# EAGLE design mainbrd (EAGLE 5.06)
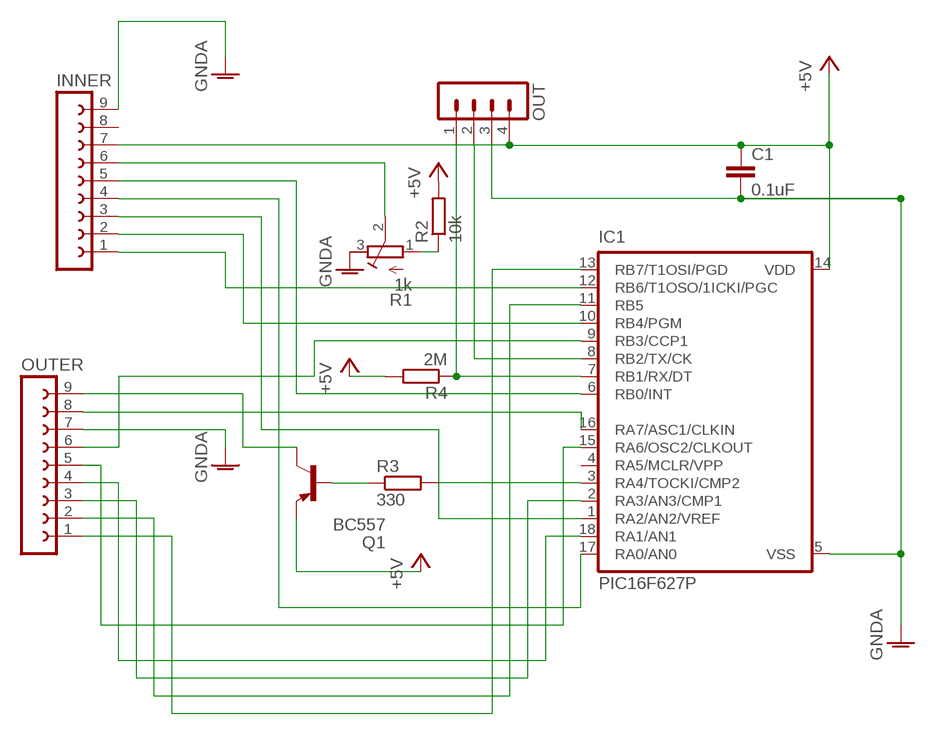
[diagram p0: schematic, sheet 1]

## Parts
C1  0.1uF  C5/2.5  [C5B2.5]
IC1  PIC16F627P  [DIL18]
INNER  FE09-1-SQU  [FE09-SQU]
OUT  MA04-1  [MA04-1]
OUTER  FE09-1-SQU  [FE09-SQU]
Q1  BC557  -PNP-TO92-CBE  [TO92-CBE]
R1  1k  R-TRIMM3339P  [RTRIM3339P]
R2  10k  R-EU_0207/10  [0207/10]
R3  330  R-EU_0207/10  [0207/10]
R4  2M  R-EU_0207/10  [0207/10]

## Nets
+5V: C1.1 IC1.14(VDD) INNER.7 OUT.4 Q1.E R2.2 R4.2
BL+V: OUTER.9 Q1.C
CONTRAST: INNER.6 R1.2(S)
D0: IC1.17(RA0/AN0) INNER.4
D1: IC1.18(RA1/AN1) OUTER.4
D2: IC1.1(RA2/AN2/VREF) INNER.3
D3: IC1.2(RA3/AN3/CMP1) OUTER.3
D4: IC1.10(RB4/PGM) INNER.2
D5: IC1.11(RB5) OUTER.2
D6: IC1.12(RB6/T1OSO/1ICKI/PGC) INNER.1
D7: IC1.13(RB7/T1OSI/PGD) OUTER.1
E1: IC1.15(RA6/OSC2/CLKOUT) OUTER.5
E2: IC1.16(RA7/ASC1/CLKIN) OUTER.8
GNDA: C1.2 IC1.5(VSS) INNER.9 OUT.3 OUTER.7 R1.3(A)
N$1: R1.1(E) R2.1
N$4: Q1.B R3.1
N$11: IC1.3(RA4/TOCKI/CMP2) R3.2
RS: IC1.9(RB3/CCP1) OUTER.6
RW: IC1.6(RB0/INT) INNER.5
SERRX: IC1.7(RB1/RX/DT) OUT.1 R4.1
SERTX: IC1.8(RB2/TX/CK) OUT.2
Unconnected: IC1.4(RA5/MCLR/VPP) INNER.8

## Library data of the parts
C1 = capacitor-wima:C: CAPACITOR naming: grid - package width
IC1 = microchip:PIC16*F62: FLASH-Based 8-Bit CMOS Microcontroller Source: http://ww1.microchip.com/downloads/en/DeviceDoc/40300C.pdf
INNER OUTER = jorjs_parts:FE09-1-SQU: FEMALE HEADER, square pads. Copied/modified from con-lsta.lbr
OUT = con-lstb:MA04-1: PIN HEADER
Q1 = transistor-neu-to92:*-PNP-: PNP Transistror
R1 = rcl:R-TRIMM: Trimm resistor
R2-R4 = rcl:R-EU_: RESISTOR, European symbol

## Board
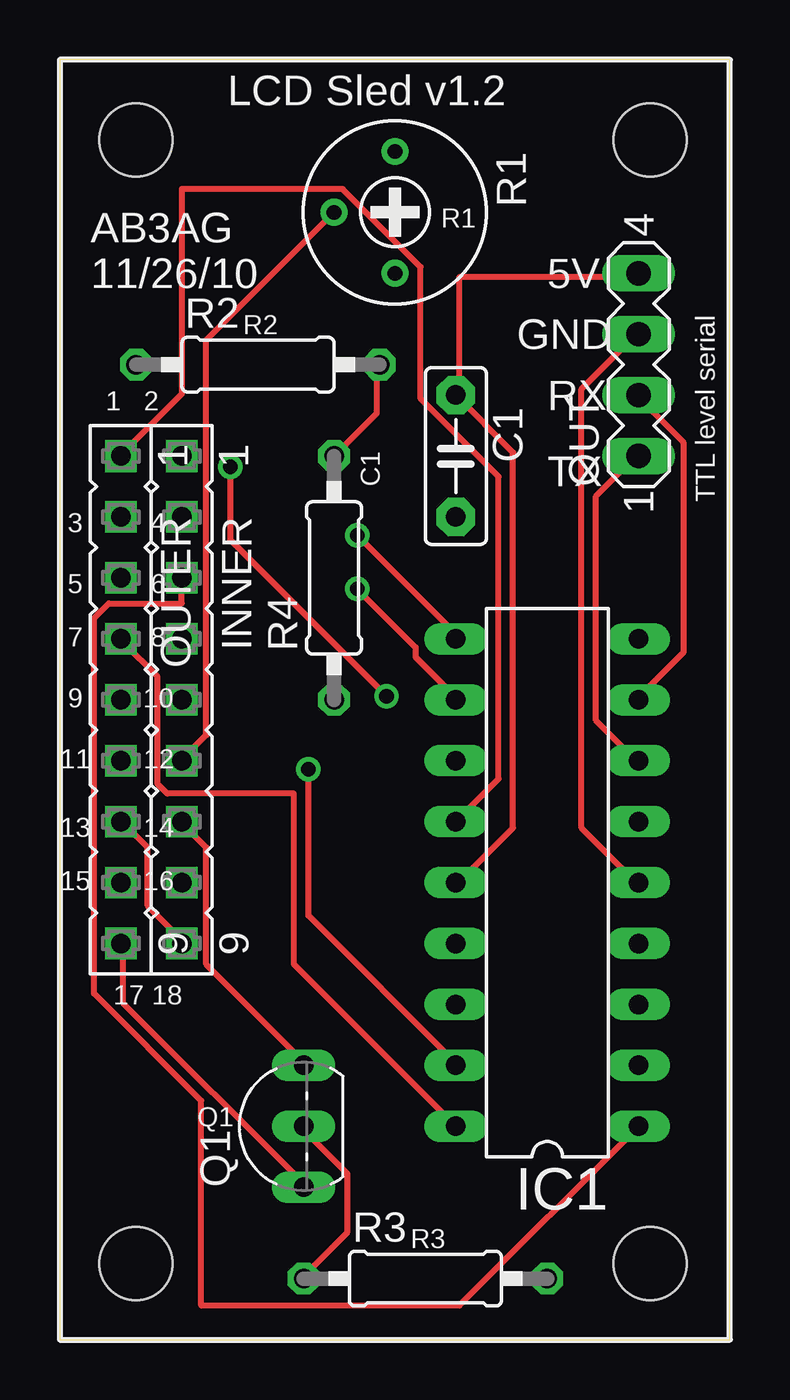
[diagram p1: board, top side]
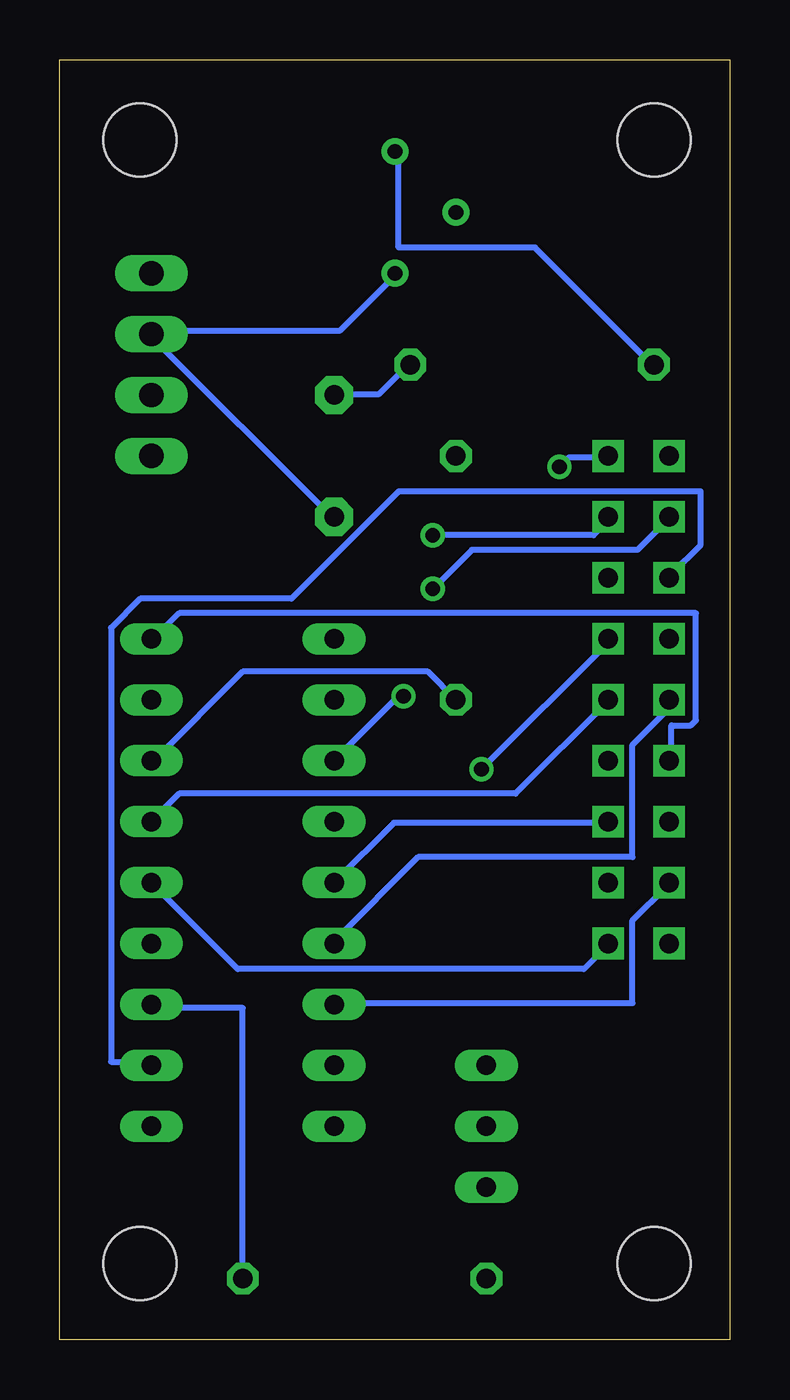
[diagram p2: board, bottom side, seen from below]

Size 27.94 x 53.34 mm. Coordinates in mm from the lower left corner, seen from the top.
Outline: 0,0 27.94,0 27.94,53.34 0,53.34 0,0
Copper layers (1*16): Top 0.035mm / dielectric 1.5mm / Bottom 0.035mm
Design rules "default": minimum track width 10mil, minimum drill 24mil, track to track 8mil, track to pad 8mil, pad to pad 8mil, via to via 8mil, smd to smd 8mil, copper to edge 40mil, drill to drill 8mil, minimum pad ring 10mil, minimum via ring 8mil, stop-mask expansion 4mil, vias tented up to drill 0mil, thermal gap 10mil

### Footprints (pad centres in the part's own frame; a part is rotated, then mirrored left to right if it is on the bottom)
C5B2.5 = drill 0.813 pad 1.6 octagon: 1 -2.54,0; 2 2.54,0
DIL18 = drill 0.813 long: 1 -10.16,-3.81; 2 -7.62,-3.81; 3 -5.08,-3.81; 4 -2.54,-3.81; 5 0,-3.81; 6 2.54,-3.81; 7 5.08,-3.81; 8 7.62,-3.81; 9 10.16,-3.81; 10 10.16,3.81; 11 7.62,3.81; 12 5.08,3.81; 13 2.54,3.81; 14 0,3.81; 15 -2.54,3.81; 16 -5.08,3.81; 17 -7.62,3.81; 18 -10.16,3.81
FE09-SQU = drill 0.813 square: 1 -10.16,0; 2 -7.62,0; 3 -5.08,0; 4 -2.54,0; 5 0,0; 6 2.54,0; 7 5.08,0; 8 7.62,0; 9 10.16,0
MA04-1 = drill 1.016 long: 1 -3.81,0; 2 -1.27,0; 3 1.27,0; 4 3.81,0
TO92-CBE = drill 0.813 long: B 0,0; C -2.54,0; E 2.54,0
RTRIM3339P = drill 0.61 round: 1 -2.54,0; 2 0,-2.54; 3 2.54,0
0207/10 = drill 0.813 octagon: 1 -5.08,0; 2 5.08,0
STAND-OFF-TIGHT = hole 3.048: 0,0

### Placement (x,y rotation side)
C1  16.51,36.83 270 top
IC1  20.32,19.05 90 top
INNER  5.08,26.67 270 top
OUT  24.13,40.64 90 top
OUTER  2.54,26.67 270 top
Q1  10.16,8.89 90 top
R1  13.97,46.99 270 top
R2  8.26,40.64 0 top
R3  15.24,2.54 0 top
R4  11.43,31.75 90 top
U$1  [STAND-OFF-TIGHT]  3.17,3.17 0 top
U$2  [STAND-OFF-TIGHT]  24.61,3.17 0 top
U$3  [STAND-OFF-TIGHT]  24.61,50.01 0 top
U$4  [STAND-OFF-TIGHT]  3.17,50.01 0 top

### Tracks (layer width: path | path; a pad name or v marks a point on that pad's centre or on a via)
+5V
  Top 0.254: R4.2 13.21,38.61 13.21,40.64 R2.2 | OUT.4 23.98,44.3 16.66,44.3 16.66,39.42 C1.1 18.9,36.98 18.9,21.34 16.66,19.1 IC1.14 | Q1.E 10.16,11.58 6.1,15.65 6.1,20.52 5.08,21.54 INNER.7
  Bottom 0.254: R2.2 13.41,40.64 14.63,39.42 16.46,39.42 C1.1 | IC1.14 14.02,21.54 5.08,21.54 INNER.7
BL+V
  Top 0.254: Q1.C 10.16,6.5 2.64,14.02 2.64,16.46 OUTER.9
CONTRAST
  Top 0.254: R1.2 6.1,41.66 6.1,25.2 5.08,24.18 INNER.6
D0  (via drill 0.61)
  Top 0.254: v10.36,23.77 10.36,17.68 16.46,11.58 IC1.17
  Bottom 0.254: v10.36,23.77 5.08,29.06 INNER.4
D1
  Top 0.254: OUTER.4 2.64,29.06 4.06,27.64 4.06,23.16 4.47,22.76 9.75,22.76 9.75,15.65 IC1.18
D2
  Top 0.254: IC1.1 16.66,1.42 5.89,1.42 5.89,9.96 1.42,14.43 1.42,30.07 2.03,30.68 5.08,30.68 INNER.3
D3
  Bottom 0.254: OUTER.3 2.44,31.9 1.22,33.12 1.22,35.36 13.82,35.36 18.29,30.89 24.59,30.89 25.81,29.67 25.81,11.58 24.18,11.58 IC1.2
D4  (via drill 0.61)
  Top 0.254: v12.39,33.53 16.46,29.46 16.46,29.26 IC1.10
  Bottom 0.254: v12.39,33.53 5.69,33.53 5.08,34.14 INNER.2
D5  (via drill 0.61)
  Top 0.254: v12.39,31.29 14.83,28.85 14.83,28.45 16.46,26.82 IC1.11
  Bottom 0.254: v12.39,31.29 10.77,32.92 3.86,32.92 2.64,34.14 OUTER.2
D6  (via drill 0.61)
  Top 0.254: v13.61,26.82 7.11,33.33 v7.11,36.37
  Bottom 0.254: v13.61,26.82 13.82,26.82 IC1.12 | v7.11,36.37 6.71,36.78 5.08,36.78 INNER.1
D7
  Top 0.254: IC1.13 18.29,23.37 18.29,35.97 15.04,39.22 15.04,44.7 11.79,47.95 5.08,47.95 5.08,39.42 2.64,36.98 OUTER.1
E1
  Bottom 0.254: OUTER.5 2.64,26.62 2.64,26.21 4.06,24.79 4.06,20.12 13.01,20.12 16.46,16.66 IC1.15
E2
  Bottom 0.254: OUTER.8 2.64,18.9 4.06,17.48 4.06,14.02 16.46,14.02 IC1.16
GNDA
  Top 0.254: INNER.9 5.08,16.66 3.66,18.09 3.66,20.52 2.64,21.54 OUTER.7 | OUT.3 23.98,41.86 21.74,39.62 21.74,21.34 23.98,19.1 IC1.5
  Bottom 0.254: R1.3 14.02,44.3 16.26,42.06 23.98,42.06 OUT.3 24.18,41.86 16.66,34.34 C1.2 | IC1.5 20.52,15.44 6.1,15.44 5.08,16.46 INNER.9
N$1
  Bottom 0.254: R1.1 13.82,49.38 13.82,45.52 8.13,45.52 3.25,40.64 R2.1
N$4
  Top 0.254: R3.1 10.16,2.64 11.99,4.47 11.99,6.91 10.16,8.74 Q1.B
N$11
  Bottom 0.254: R3.2 20.32,13.82 23.98,13.82 IC1.3
RS
  Bottom 0.254: OUTER.6 2.44,24.18 2.44,25.6 1.63,25.6 1.42,25.81 1.42,30.28 22.96,30.28 23.98,29.26 IC1.9
RW
  Bottom 0.254: INNER.5 5.08,26.62 8.94,22.76 22.96,22.76 IC1.6
SERRX
  Top 0.254: OUT.1 23.98,36.78 22.35,35.15 22.35,25.81 23.98,24.18 IC1.7
  Bottom 0.254: R4.1 12.6,27.84 20.32,27.84 23.98,24.18 IC1.7
SERTX
  Top 0.254: IC1.8 24.18,26.82 26.01,28.65 26.01,37.39 24.18,39.22 OUT.2

### Text on the board
tPlace: LCD Sled v1.2 | AB3AG | R1 | 11/26/10 | 5V | R2 | GND | 1 2 | RX | C1 | TX | TTL level serial | 3 4 | 5 6 | 7 8 | 9 10 | 11 12 | 13 14 | 15 16 | 17 18 | Q1 | R3